# Altium schematic sheet Driver.SchDoc: Driver
size A4; SheetNumber: 6; SheetTotal: 6
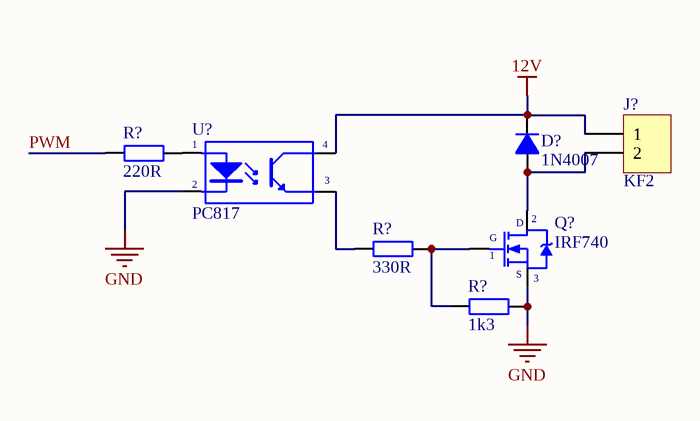
[diagram p0: Driver.SchDoc]

## Parts
(Parts that share a designator on the sheet are numbered #1, #2 ... from top to bottom, then left to right.)
D?  1N4007  [D1A]
J?  KF2  [KF2-3.5]
Q?  IRF740  [QTO-220]
R?#1  220R  [RES-SMD-0805]
R?#2  330R  [RES-SMD-0805]
R?#3  1k3  [RES-SMD-0805]
U?  PC817  [SMD-4]

## Nets
12V: D?.2(K) J?.1 U?.4(C)
GND: Q?.3(S) R?#3.2 U?.2(K)
PWM: R?#1.1
NetD?_1: D?.1(A) J?.2 Q?.2(D)
NetQ?_1: Q?.1(G) R?#2.1 R?#3.1
NetR?#1_2: R?#1.2 U?.1(A)
NetR?#2_2: R?#2.2 U?.3(E)

## Notes on the sheet
- Document Title:
- ĐH BKHN
- Project Name:
- Size:
- A4
- Reviewer:
- Designer:
- Nguyen Ba Hoang
- Revision:
- 1 Dai Co Viet Street
- Bach Khoa, Hai Ba Trung
- Ha Noi
- File:
- Sheet:
- of
- Date:

## Library data of the parts
D? = D1A: Diode 1A; Value: 1N4007
J? = KF2: Manufacturer: Würth Elektronik eiSos GmbH; partNo: 691103110002; ComponentLink1 Description: Manufacturer; ComponentLink2 Description: Datasheet; NoPins: 2; Created Date: 29 October 2013; ComponentLink1URL: http://www.we-online.com; ComponentLink2URL: http://katalog.we-online.de/em/datasheet/6911031100xx.pdf; Created by: Karrer Zheng
Q? = IRF840: MOSFET N - CHANNEL 500V - 0.75 - 8A - TO-220; Value: IRF840
R?#1-R?#3 = R1/4W: Resistor 1/4W
  R?#1: Supplier Part Num: Điện Trở 220 Ohm 0805 5%; Supplier: Thegioiic
  R?#2: Supplier Part Num: Điện Trở 330 Ohm 0805 5%
  R?#3: Supplier Part Num: Điện Trở 1.3 KOhm 0805 5%
U? = PC817: Single Opto; Value: PC817; Parameter 1: *